# Altium schematic sheet leds.SchDoc
size A4; SheetNumber: 2; SheetTotal: 2
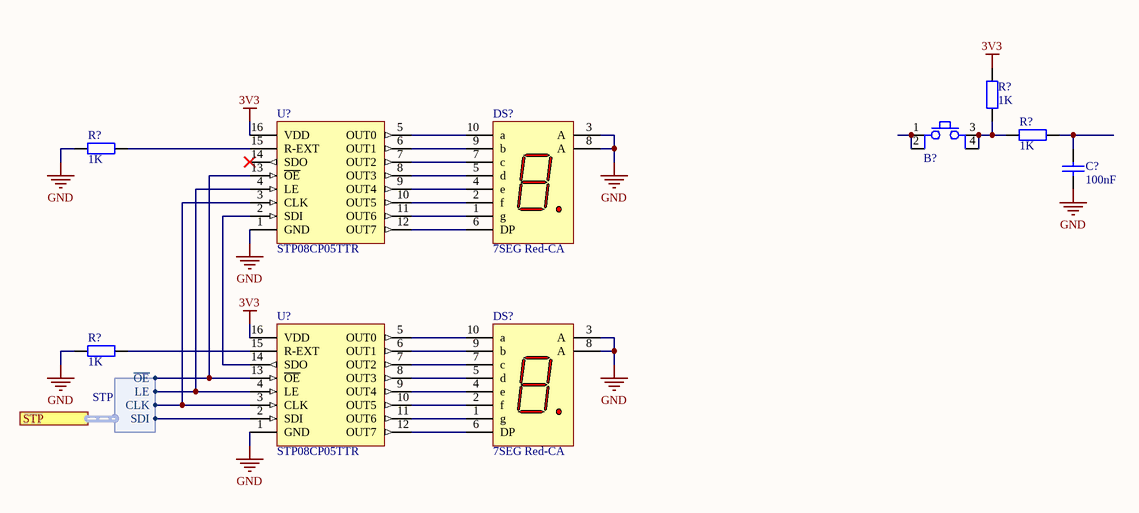
[diagram p0: leds.SchDoc]

## Parts
(Parts that share a designator on the sheet are numbered #1, #2 ... from top to bottom, then left to right.)
B?  Button  [FP_BTN_SMD]  (value not drawn)
C?  100nF  [FP_0805_CAP_085]
DS?#1  7SEG Red-CA  [FP_7SEG]
DS?#2  7SEG Red-CA  [FP_7SEG]
R?#1  1K  [FP_0805_RES]
R?#2  1K  [FP_0805_RES]
R?#3  1K  [FP_0805_RES]
R?#4  1K  [FP_0805_RES]
U?#1  STP08CP05TTR  [TSOP65P640X120-16M]
U?#2  STP08CP05TTR  [TSOP65P640X120-16M]

## Ports
STP (harness STP)

## Harnesses
STP: ~{OE}, LE, CLK, SDI

## Nets
3V3: R?#1.2 U?#1.16(VDD) U?#2.16(VDD)
GND: C?.1 DS?#1.3(A) DS?#1.8(A) DS?#2.3(A) DS?#2.8(A) R?#3.2 R?#4.2 U?#1.1(GND) U?#2.1(GND)
NetB?_1: B?.1 B?.2
NetB?_3: B?.3 B?.4 R?#1.1 R?#2.1
NetC?_2: C?.2 R?#2.2
NetDS?#1_1: DS?#1.1(g) U?#1.11(OUT6)
NetDS?#1_2: DS?#1.2(f) U?#1.10(OUT5)
NetDS?#1_4: DS?#1.4(e) U?#1.9(OUT4)
NetDS?#1_5: DS?#1.5(d) U?#1.8(OUT3)
NetDS?#1_6: DS?#1.6(DP) U?#1.12(OUT7)
NetDS?#1_7: DS?#1.7(c) U?#1.7(OUT2)
NetDS?#1_9: DS?#1.9(b) U?#1.6(OUT1)
NetDS?#1_10: DS?#1.10(a) U?#1.5(OUT0)
NetDS?#2_1: DS?#2.1(g) U?#2.11(OUT6)
NetDS?#2_2: DS?#2.2(f) U?#2.10(OUT5)
NetDS?#2_4: DS?#2.4(e) U?#2.9(OUT4)
NetDS?#2_5: DS?#2.5(d) U?#2.8(OUT3)
NetDS?#2_6: DS?#2.6(DP) U?#2.12(OUT7)
NetDS?#2_7: DS?#2.7(c) U?#2.7(OUT2)
NetDS?#2_9: DS?#2.9(b) U?#2.6(OUT1)
NetDS?#2_10: DS?#2.10(a) U?#2.5(OUT0)
NetR?#3_1: R?#3.1 U?#1.15(R-EXT)
NetR?#4_1: R?#4.1 U?#2.15(R-EXT)
NetU?#1_2: U?#1.2(SDI) U?#2.14(SDO)
NetU?#1_3: U?#1.3(CLK) U?#2.3(CLK) ; port STP.CLK
NetU?#1_4: U?#1.4(LE) U?#2.4(LE)
NetU?#1_13: U?#1.13(~{OE}) U?#2.13(~{OE})
NetU?#2_2: U?#2.2(SDI) ; port STP.SDI

Not connected (* = marked no-connect by the designer): U?#1 14(SDO)*

## Library data of the parts
B? = Button 4P: Push button
C? = CAP: Capacitor; Value: 100nF
DS?#1 DS?#2 = 7SEG Red-CA: 7-Segment Display: CA, RH DP; MinimumIntensity: 360 ucd; Note: IF = 5 mA; Colour: High Efficiency Red (HER); Note: Pins 1 and 6 are redundant Anodes.; Published: 8-Jun-2000; LatestRevisionDate: 17-Dec-2003; LatestRevisionNote: Schematic revised, PCB Footprint replaced.; DatasheetVersion: 19-Feb-2002; PackageVersion: 11-Feb-2002; PackageReference: A; Publisher: Altium Limited; PackageDescription: LED, 7-Segment Display, 7.62 mm, RHD; 10 Leads; Row Space 5.08 mm; Pitch 2.54 mm; ComponentLink1Description: Manufacturer Link; ComponentLink1URL: http://www.agilent.com/
R?#1-R?#4 = RES: Resistor; Value: 1K
U?#1 U?#2 = STP08CP05TTR: Low voltage, low current power 8-bit shift register